# Altium schematic sheet MB895.SchDoc
size A4; Revision: C.1(PCB.SCH)
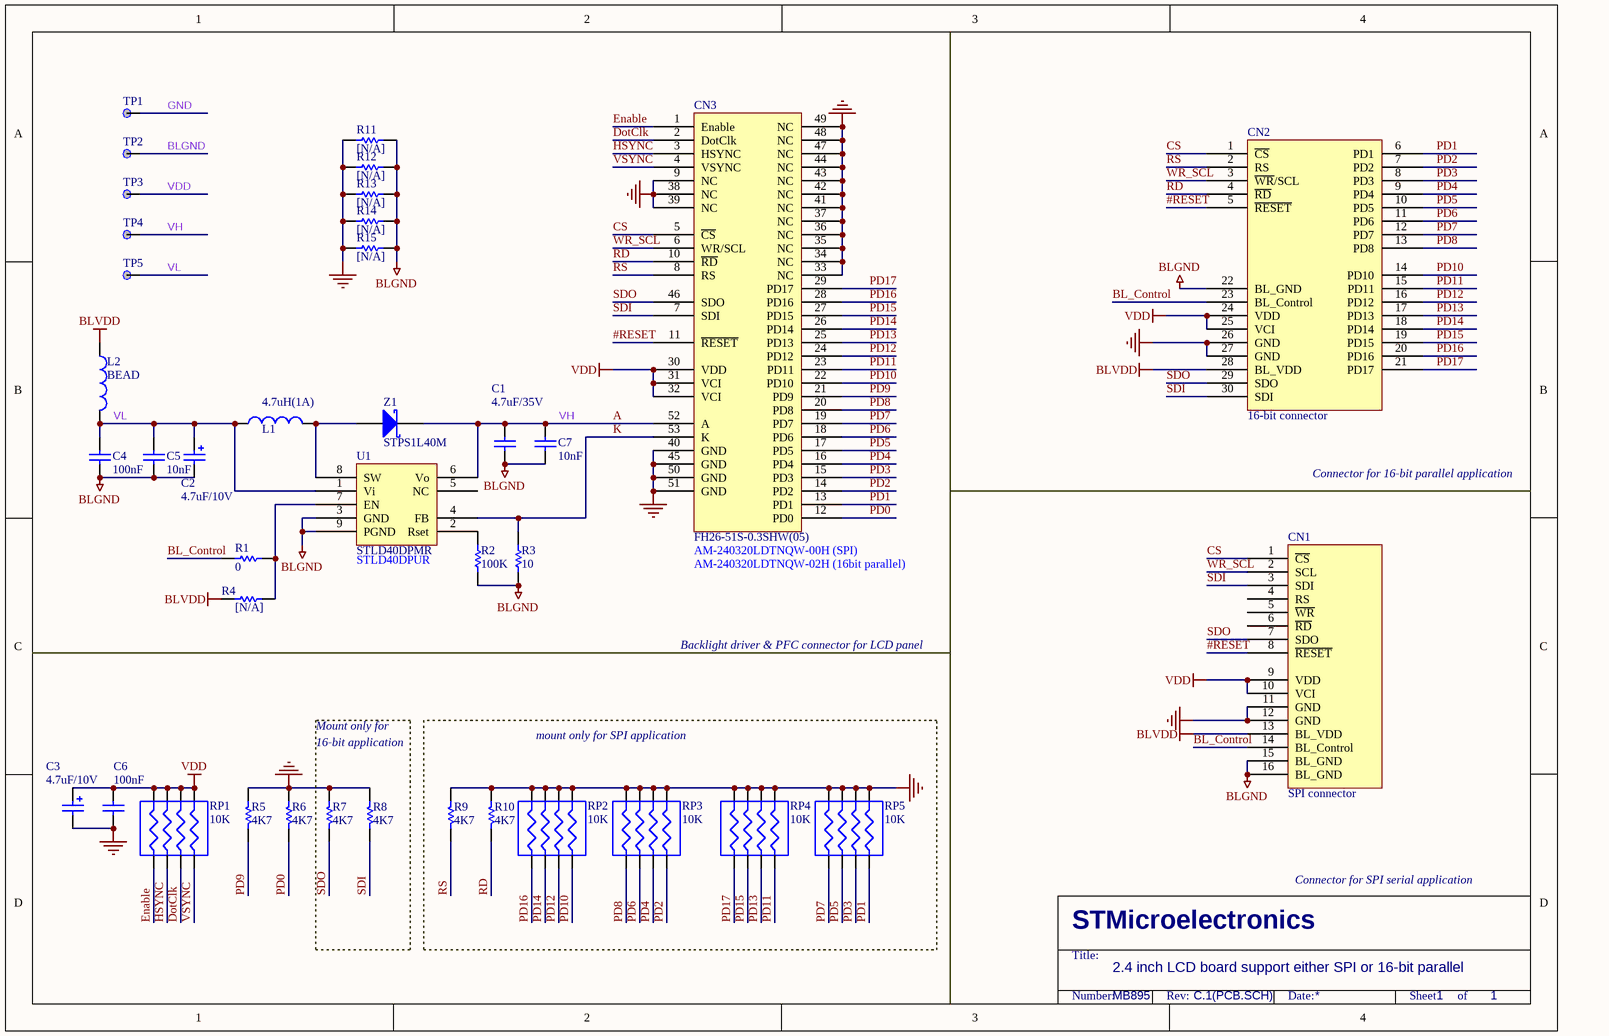
[diagram p0: MB895.SchDoc]

## Parts
C1  4.7uF/35V  [3225C]
C2  4.7uF/10V  [3225C]
C3  4.7uF/10V  [1206C]
C4  100nF  [0402C]
C5  10nF  [0402C]
C6  100nF  [0402C]
C7  10nF  [0603C]
CN1  SPI connector  [AM240320A]
CN2  16-bit connector  [AM240*320B]
CN3  FH26-51S-0.3SHW(05)
L1  4.7uH(1A)  [3225L]
L2  BEAD  [0603L]
R1  0  [0603R]
R2  100K  [0603R]
R3  10  [0603R]
R4  [N/A]  [0603R]
R5  4K7  [0402R]
R6  4K7  [0402R]
R7  4K7  [0402R]
R8  4K7  [0402R]
R9  4K7  [0402R]
R10  4K7  [0402R]
R11  [N/A]  [0603R]
R12  [N/A]  [0603R]
R13  [N/A]  [0603R]
R14  [N/A]  [0603R]
R15  [N/A]  [0603R]
RP1  10K  [RES-4B]
RP2  10K  [RES-4B]
RP3  10K  [RES-4B]
RP4  10K  [RES-4B]
RP5  10K  [RES-4B]
TP1  (no value)  [TP]
TP2  (no value)  [TP]
TP3  (no value)  [TP]
TP4  (no value)  [TP]
TP5  (no value)  [TP]
U1  STLD40DPMR  [QFNT8]
Z1  STPS1L40M  [DO216AA]

## Blocks framed on the sheet
mount only for SPI application: R9 R10 RP2-RP5

## Nets
BLGND: C1.2 C2.2 C4.1 C5.1 C7.1 CN1.15(BL_GND) CN1.16(BL_GND) CN2.22(BL_GND) R2.2 R3.1 R11.1 R12.1 R13.1 R14.1 R15.1 TP2.1 U1.3(GND) U1.9(PGND)
BLVDD: CN1.13(BL_VDD) CN2.28(BL_VDD) L2.1 R4.2
GND: C3.2 C6.1 CN1.11(GND) CN1.12(GND) CN2.26(GND) CN2.27(GND) CN3.9(NC) CN3.33(NC) CN3.34(NC) CN3.35(NC) CN3.36(NC) CN3.37(NC) CN3.38(NC) CN3.39(NC) CN3.40(GND) CN3.41(NC) CN3.42(NC) CN3.43(NC) CN3.44(NC) CN3.45(GND) CN3.47(NC) CN3.48(NC) CN3.49(NC) CN3.50(GND) CN3.51(GND) R5.1 R6.1 R7.1 R8.1 R9.1 R10.1 R11.2 R12.2 R13.2 R14.2 R15.2 RP2.2(R1) RP2.4(R3) RP2.6(R2) RP2.8(R0) RP3.2(R1) RP3.4(R3) RP3.6(R2) RP3.8(R0) RP4.2(R1) RP4.4(R3) RP4.6(R2) RP4.8(R0) RP5.2(R1) RP5.4(R3) RP5.6(R2) RP5.8(R0) TP1.1
VDD: C3.1 C6.2 CN1.9(VDD) CN1.10(VCI) CN2.24(VDD) CN2.25(VCI) CN3.30(VDD) CN3.31(VCI) CN3.32(VCI) RP1.2(R1) RP1.4(R3) RP1.6(R2) RP1.8(R0) TP3.1
#RESET: CN1.8(~{RESET}) CN2.5(~{RESET}) CN3.11(~{RESET})
A: C1.1 C7.2 CN3.52(A) TP4.1 U1.6(Vo) Z1.2(K)  [also labelled VH]
BL_Control: CN1.14(BL_Control) CN2.23(BL_Control) R1.2
CS: CN1.1(~{CS}) CN2.1(~{CS}) CN3.5(~{CS})
DotClk: CN3.2(DotClk) RP1.5(R3)
Enable: CN3.1(Enable) RP1.1(R0)
HSYNC: CN3.3(HSYNC) RP1.3(R2)
K: CN3.53(K) R3.2 U1.4(FB)
PD0: CN3.12(PD0) R6.2
PD1: CN2.6(PD1) CN3.13(PD1) RP5.7(R1)
PD2: CN2.7(PD2) CN3.14(PD2) RP3.7(R1)
PD3: CN2.8(PD3) CN3.15(PD3) RP5.5(R3)
PD4: CN2.9(PD4) CN3.16(PD4) RP3.5(R3)
PD5: CN2.10(PD5) CN3.17(PD5) RP5.3(R2)
PD6: CN2.11(PD6) CN3.18(PD6) RP3.3(R2)
PD7: CN2.12(PD7) CN3.19(PD7) RP5.1(R0)
PD8: CN2.13(PD8) CN3.20(PD8) RP3.1(R0)
PD9: CN3.21(PD9) R5.2
PD10: CN2.14(PD10) CN3.22(PD10) RP2.7(R1)
PD11: CN2.15(PD11) CN3.23(PD11) RP4.7(R1)
PD12: CN2.16(PD12) CN3.24(PD12) RP2.5(R3)
PD13: CN2.17(PD13) CN3.25(PD13) RP4.5(R3)
PD14: CN2.18(PD14) CN3.26(PD14) RP2.3(R2)
PD15: CN2.19(PD15) CN3.27(PD15) RP4.3(R2)
PD16: CN2.20(PD16) CN3.28(PD16) RP2.1(R0)
PD17: CN2.21(PD17) CN3.29(PD17) RP4.1(R0)
RD: CN2.4(~{RD}) CN3.10(~{RD}) R10.2
RS: CN2.2(RS) CN3.8(RS) R9.2
SDI: CN1.3(SDI) CN2.30(SDI) CN3.7(SDI) R8.2
SDO: CN1.7(SDO) CN2.29(SDO) CN3.46(SDO) R7.2
VL: C2.1 C4.2 C5.2 L1.1 L2.2 TP5.1 U1.1(Vi)
VSYNC: CN3.4(VSYNC) RP1.7(R1)
WR_SCL: CN1.2(SCL) CN2.3(~{WR}/SCL) CN3.6(WR/SCL)
NetL1_2: L1.2 U1.8(SW) Z1.1(A)
NetR1_1: R1.1 R4.1 U1.7(EN)
NetR2_1: R2.1 U1.2(Rset)

Not connected (* = marked no-connect by the designer): CN1 4(RS) 5(~{WR}) 6(~{RD}); U1 5(NC)

## Notes on the sheet
- Connector for 16-bit parallel application
- (near U1) STLD40DPUR
- (near CN3) AM-240320LDTNQW-00H (SPI)
- (near CN3) AM-240320LDTNQW-02H (16bit parallel)
- Backlight driver & PFC connector for LCD panel
- Mount only for
- 16-bit application
- Connector for SPI serial application
- 2.4 inch LCD board support either SPI or 16-bit parallel
- MB895
- 1
- STMicroelectronics
- Title:
- Number:
- Rev:
- Date:
- Sheet       of

## Library data of the parts
C1 C4-C7 = CAP: Capacitor; Value: 100pF; Published: 8-Jun-2000; Revision: July-2002: Re-released for DXP Platform.; Publisher: Altium Limited
C2 C3 = Cap Pol1: Polarized Capacitor (Radial); Value: 100pF; Published: 8-Jun-2000; Revision: July-2002: Re-released for DXP Platform.; Publisher: Altium Limited
CN1 CN2 = ColorLCD_module
CN3 = AM240320LTNQW00H
L1 L2 = Inductor: Value: 100uH; Published: 8-Jun-2000; Revision: July-2002: Re-released for DXP Platform.; Publisher: Altium Limited
R1-R10 = Res1: Resistor; Value: 1K; Published: 8-Jun-2000; Revision: July-2002: Re-released for DXP Platform.; Publisher: Altium Limited
R11-R15 = Res1: Resistor; Published: *; Revision: *; Publisher: *; Value: *
RP1-RP5 = RES4B
TP1-TP5 = TP
Z1 = D Schottky: Schottky Diode; Code - JEDEC: DO-214-AA; Published: 8-Jun-2000; Revision: July-2002: Re-released for DXP Platform.; Publisher: Altium Limited